# EAGLE design 211_7seg (EAGLE 7.6.0)
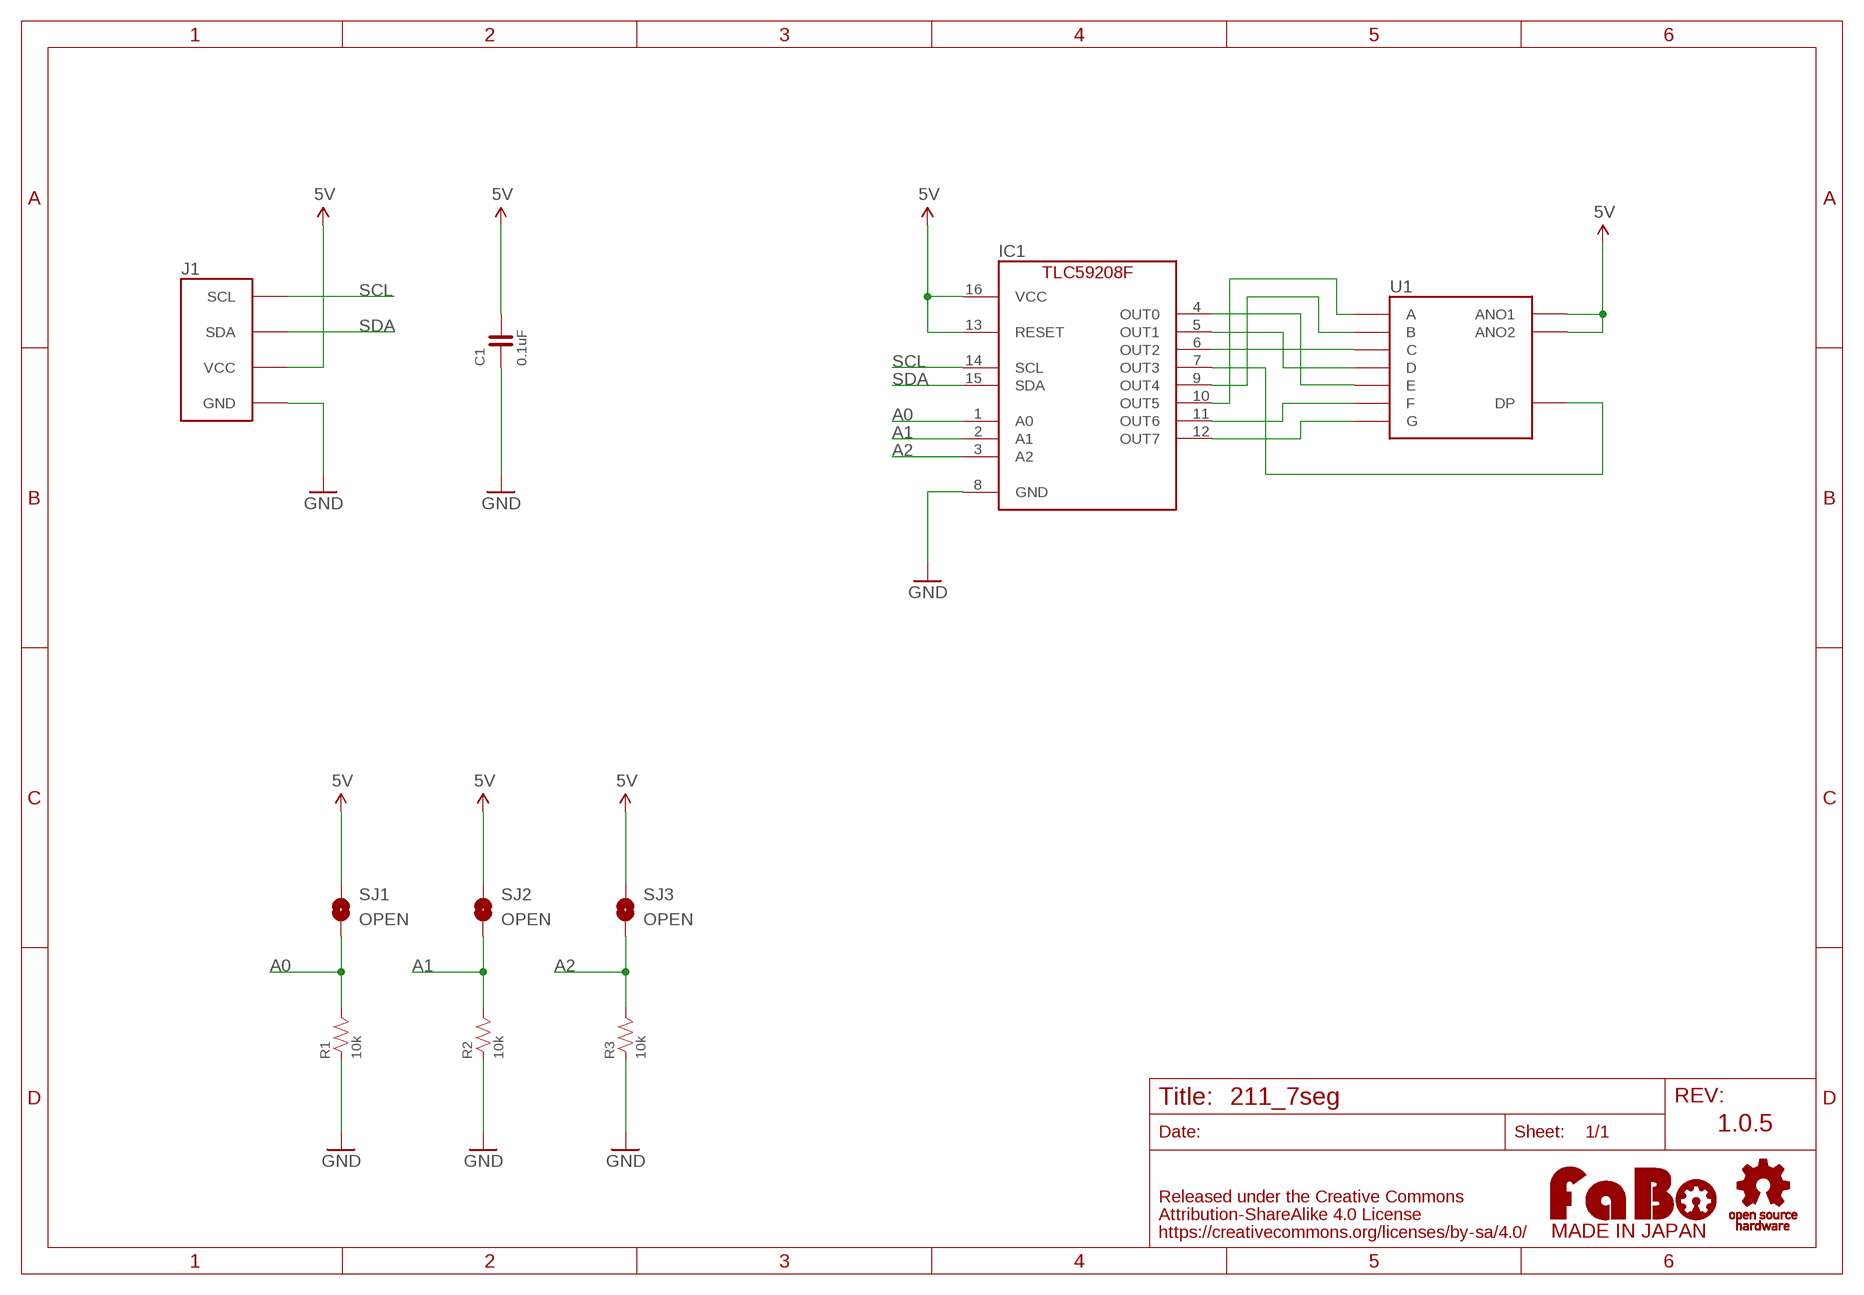
[diagram p0: schematic, sheet 1]

## Parts
C1  0.1uF  CAPACITOR-0603  [0603]
IC1  TLC59208FIPWR  [TSSOP16]
J1  FABO_BRICK_I2C  [FABO_BRICK_I2C]
R1  10k  RESISTOR-0603  [0603]
R2  10k  RESISTOR-0603  [0603]
R3  10k  RESISTOR-0603  [0603]
SJ1  OPEN  SMD-JUMPER-2-OPEN  [SMD-JUMPER-2-OPEN]
SJ2  OPEN  SMD-JUMPER-2-OPEN  [SMD-JUMPER-2-OPEN]
SJ3  OPEN  SMD-JUMPER-2-OPEN  [SMD-JUMPER-2-OPEN]
U1  7SEG_ANO  [A-551SRD]
U$2  LOGO_OSHW-M_BOTTOM  [LOGO_OSHW_M_BOTTOM]
U$4  LOGO_FABO-M  [LOGO_FABO_MS]

## Nets
5V: C1.2 IC1.13(RESET) IC1.16(VCC) J1.VCC SJ1.1 SJ2.1 SJ3.1 U1.ANO1 U1.ANO2
A0: IC1.1(A0) R1.2 SJ1.2
A1: IC1.2(A1) R2.2 SJ2.2
A2: IC1.3(A2) R3.2 SJ3.2
GND: C1.1 IC1.8(GND) J1.GND R1.1 R2.1 R3.1
N$1: IC1.4(OUT0) U1.E
N$2: IC1.5(OUT1) U1.D
N$3: IC1.6(OUT2) U1.C
N$4: IC1.7(OUT3) U1.DP
N$5: IC1.9(OUT4) U1.B
N$6: IC1.10(OUT5) U1.A
N$7: IC1.11(OUT6) U1.F
N$8: IC1.12(OUT7) U1.G
SCL: IC1.14(SCL) J1.SCL
SDA: IC1.15(SDA) J1.SDA

## Notes on the sheet
- 1.0.5

## Library data of the parts
C1 = FaBo-Capacitor:CAPACITOR: CAPACITOR
IC1 = FaBo-LED:TLC59208F
J1 = FaBo-Template:FABO_BRICK_I2C: FaBo Brick I2C
R1-R3 = FaBo-Resistors:RESISTOR: RESISTOR
SJ1-SJ3 = FaBo-Supply:SMD-JUMPER-2
U1 = FaBo-LED:7SEG_ANO
U$2 = FaBo-etc:LOGO_OSHW
U$4 = FaBo-etc:LOGO_FABO

## Board
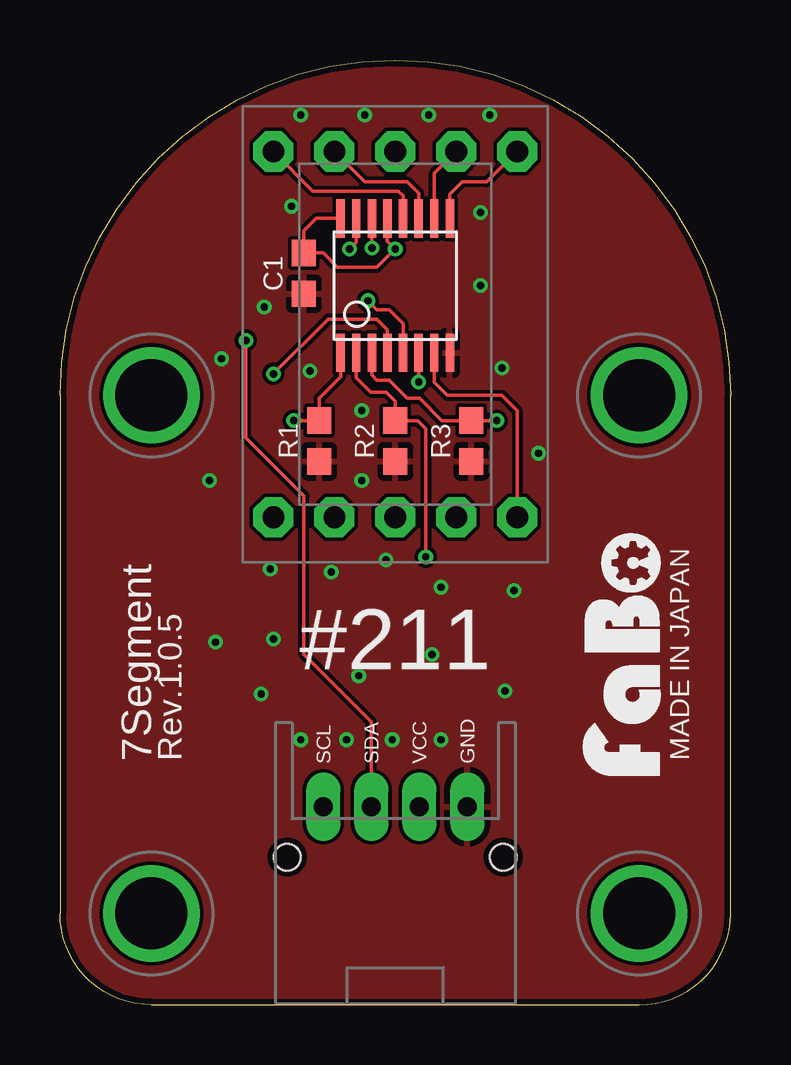
[diagram p1: board, top side]
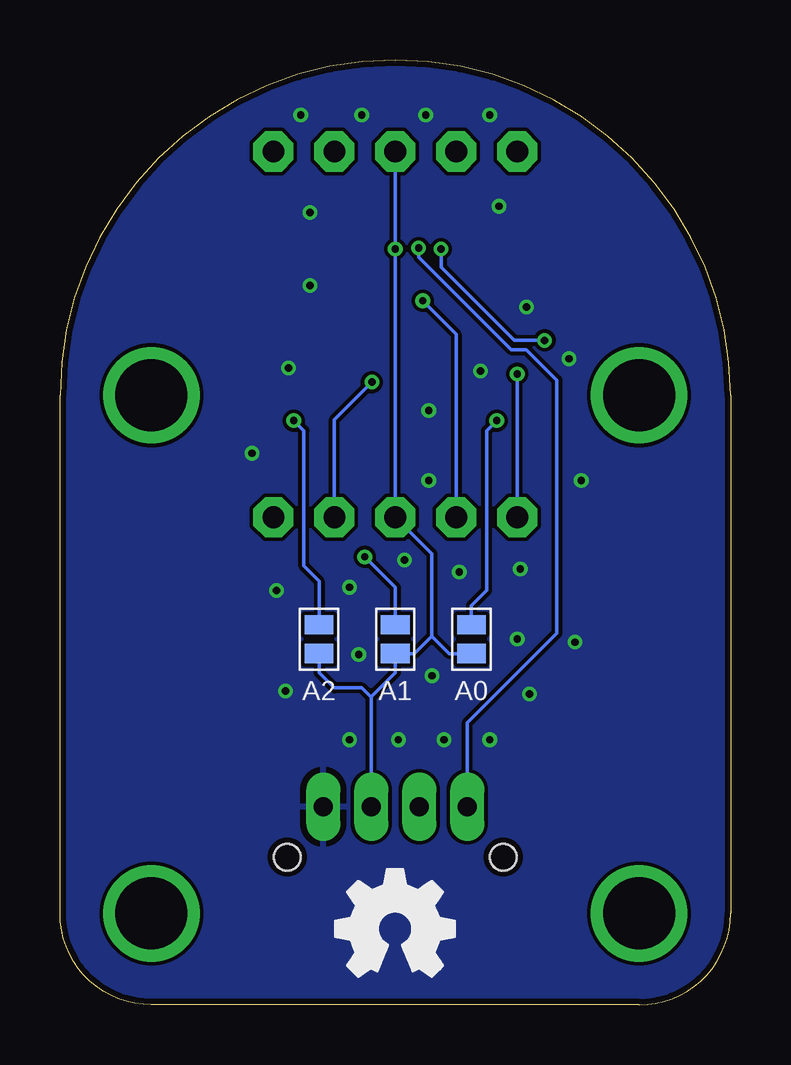
[diagram p2: board, bottom side, seen from below]

Size 27.94 x 39.37 mm. Coordinates in mm from the lower left corner, seen from the top.
Copper layers (1*16): Top 0.035mm / dielectric 1.5mm / Bottom 0.035mm
Design rules "SeeedStudio_2layer_DRU_no_angle_20140221": minimum track width 6mil, minimum drill 12mil, track to track 6mil, track to pad 6mil, pad to pad 6mil, via to via 6mil, smd to smd 0mil, copper to edge 10mil, drill to drill 10mil, minimum pad ring 10mil, minimum via ring 6mil, stop-mask expansion 2mil, vias tented up to drill 100mil, thermal gap 10mil

### Footprints (pad centres in the part's own frame; a part is rotated, then mirrored left to right if it is on the bottom)
0603 = smd 1.1 x 1: 1 -0.85,0; 2 0.85,0
TSSOP16 = smd 0.35 x 1.6: 1 -2.275,-2.8; 2 -1.625,-2.8; 3 -0.975,-2.8; 4 -0.325,-2.8; 5 0.325,-2.8; 6 0.975,-2.8; 7 1.625,-2.8; 8 2.275,-2.8; 9 2.275,2.8; 10 1.625,2.8; 11 0.975,2.8; 12 0.325,2.8; 13 -0.325,2.8; 14 -0.975,2.8; 15 -1.625,2.8; 16 -2.275,2.8
FABO_BRICK_I2C = drill 0.8 pad 1.422 long: GND 3,-10.795; SCL -3,-10.795; SDA -1,-10.795; VCC 1,-10.795 | drill 3 pad 3.81: P$1 -10.16,6.35; P$2 10.16,6.35; P$3 -10.16,-15.24; P$4 10.16,-15.24 | hole 1.1: -4.5,-12.895; 4.5,-12.895
SMD-JUMPER-2-OPEN = smd 0.8 x 1.2: 1 -0.6,0; 2 0.6,0
A-551SRD = drill 0.9 pad 1.676 octagon: A 2.54,7.62; ANO1 0,-7.62; ANO2 0,7.62; B 5.08,7.62; C 2.54,-7.62; D -2.54,-7.62; DP 5.08,-7.62; E -5.08,-7.62; F -2.54,7.62; G -5.08,7.62

### Placement (x,y rotation side)
C1  10.16,30.48 90 top
IC1  13.97,29.97 0 top
J1  13.97,19.05 0 top
R1  10.79,23.5 90 top
R2  13.97,23.5 90 top
R3  17.14,23.5 90 top
SJ1  10.79,15.24 90 bottom
SJ2  13.97,15.24 90 bottom
SJ3  17.14,15.24 90 bottom
U1  13.97,27.94 0 top
U$2  13.97,3.17 0 top
U$4  25.4,14.61 90 top

### Tracks (layer width: path | path; a pad name or v marks a point on that pad's centre or on a via)
5V  (via drill 0.3)
  Top 0.152: IC1.13 13.64,31.82 v13.97,31.5 13.21,30.73 11.56,30.73 10.96,31.33 C1.2 10.16,32.26 10.67,32.77 IC1.16
  Bottom 0.152: U1.ANO2 v13.97,31.5 U1.ANO1 12.45,18.8 12.45,15.37 | J1.VCC 14.97,12.84 | 14.97,12.84 13.97,13.84 SJ2.1 13.17,14.64 12.45,15.37 | SJ3.1 17.14,13.84 16.51,13.21 15.37,13.21 15,12.84 14.97,12.84 | SJ1.1 11.72,14.64 12.45,15.37
A0  (via drill 0.3)
  Top 0.152: IC1.1 11.7,26.17 10.79,25.27 R1.2 v9.74,24.34
  Bottom 0.152: SJ1.2 10.79,16.64 10.16,17.27 10.16,23.93 v9.74,24.34
A1  (via drill 0.3)
  Top 0.152: IC1.2 12.35,26.14 12.95,25.53 13.59,25.53 13.97,25.15 R2.2 14.9,24.34 15.24,24 v15.24,18.67
  Bottom 0.152: v15.24,18.67 13.97,17.4 SJ2.2
A2  (via drill 0.3)
  Top 0.152: IC1.3 12.99,26.25 13.21,26.04 13.72,26.04 14.48,25.27 14.99,25.27 15.91,24.34 R3.2 v18.2,24.34
  Bottom 0.152: SJ3.2 17.14,17.65 17.78,18.29 17.78,23.93 v18.2,24.34
GND  (via drill 0.3)
  other vias: 8.76,18.16 11.3,18.03 13.59,18.54 15.88,17.4 18.92,17.27 8.89,15.24 15.49,14.61 18.54,13.08 12.45,13.72 10.03,11.05 11.94,11.05 13.84,11.05 15.88,11.05 6.48,15.11 8.38,12.95 6.22,21.84 12.57,24.77 12.57,21.84 10.41,26.42 18.41,26.54 8.51,29.08 6.73,26.92 17.53,29.97 9.65,33.27 17.53,33.02 15.37,37.08 12.7,37.08 10.03,37.08 17.91,37.08 19.94,22.99
  pour Bottom: 0,0 27.94,0 27.94,39.37 0,39.37
  pour Top: 0,0 27.94,0 27.94,39.37 0,39.37
N$1  (via drill 0.3)
  Top 0.152: IC1.4 13.64,28.14 13.21,28.57 11.18,28.57 v8.89,26.29
  Bottom 0.152: U1.E v8.89,26.29
N$2  (via drill 0.3)
  Top 0.152: IC1.5 14.29,28.38 13.72,28.96 13.21,28.96 v12.83,29.34
  Bottom 0.152: v12.83,29.34 11.43,27.94 U1.D
N$3  (via drill 0.3)
  Top 0.152: IC1.6 v14.95,25.95
  Bottom 0.152: U1.C 16.51,24.38 v14.95,25.95
N$4
  Top 0.152: IC1.7 15.6,25.93 16.13,25.4 18.41,25.4 19.05,24.77 U1.DP
N$5
  Top 0.152: U1.B 17.78,34.29 16.76,34.29 16.25,33.77 IC1.9
N$6
  Top 0.152: IC1.10 15.6,34.65 U1.A
N$7
  Top 0.152: U1.F 12.7,34.29 14.48,34.29 14.95,33.82 IC1.11
N$8
  Top 0.152: U1.G 10.54,33.91 14.1,33.91 14.29,33.71 IC1.12
SCL  (via drill 0.3)
  Top 0.152: IC1.14 v12.99,31.54
  Bottom 0.152: J1.SCL 10.97,11.76 7.24,15.49 7.24,26.04 8.51,27.3 9.14,27.3 12.99,31.16 v12.99,31.54
SDA  (via drill 0.3)
  Top 0.152: IC1.15 12.35,31.78 v12.06,31.5 | J1.SDA 12.97,11.79 10.16,14.61 10.16,21.21 7.75,23.62 v7.75,27.69
  Bottom 0.152: v12.06,31.5 12.06,30.73 9.02,27.69 v7.75,27.69

### Text on the board
tPlace: MADE IN JAPAN | #211 | 7Segment | Rev.1.0.5
bPlace: A0 | A1 | A2